# Altium project Power_Clock_proto.PrjPcb
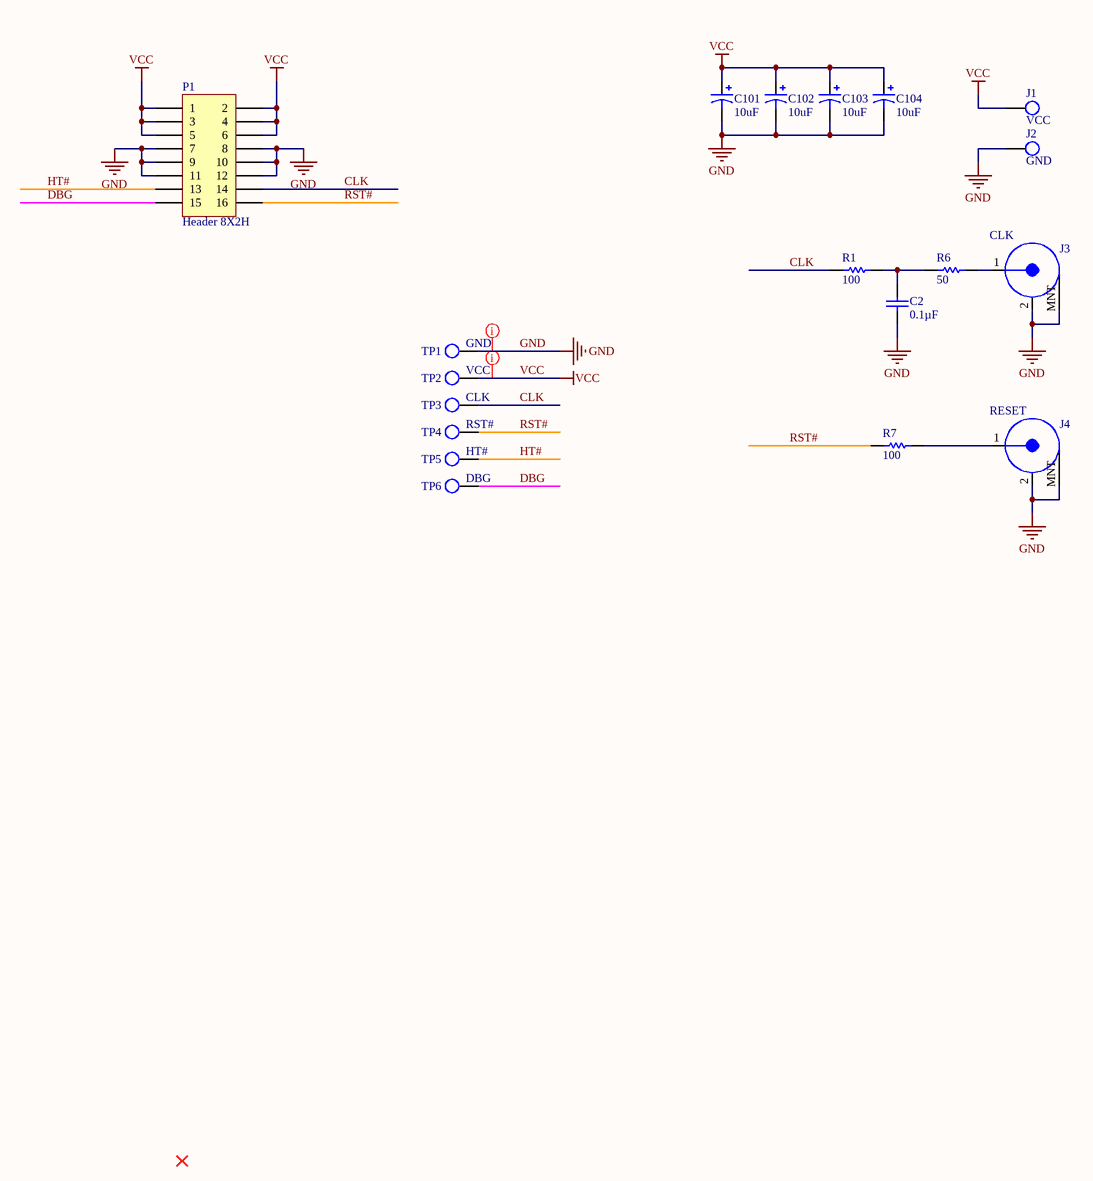
[diagram p0: Sheet1.SchDoc]
2 sheets, 19 parts. Net scope: strictly hierarchical (ports join the sheet entries above them; power ports are local).
Board file: Power_Clock_proto.PcbDoc
Sheets:
  Sheet1.SchDoc
  Sheet2.SchDoc

## Sheet Sheet1.SchDoc
size B; Author: E. Sims; Organization: Let's Build Rockets Inc.; SheetNumber: 1; SheetTotal: 3

### Parts
C2  Capacitance: 0.1µF  [VISH-K104K15X7RF5TL2]  (hidden comment: K104K15X7RF5TL2)
C101  value 10uF  [C5x7]  (hidden comment: Cap Pol5)
C102  value 10uF  [C5x7]  (hidden comment: Cap Pol5)
C103  value 10uF  [C5x7]  (hidden comment: Cap Pol5)
C104  value 10uF  [C5x7]  (hidden comment: Cap Pol5)
J1  VCC  [CT3151SP-2]
J2  GND  [CT3151SP-0]
J3  CLK  [BNC R/A]
J4  RESET  [BNC R/A]
P1  Header 8X2H  [HDR2X8H]
R1  value 100  [AXIAL-0.3]  (hidden comment: Res1)
R6  value 50  [AXIAL-0.3]  (hidden comment: Res1)
R7  value 100  [AXIAL-0.3]  (hidden comment: Res1)
TP1  GND  [KSTN-5011_V]  (no BOM)
TP2  VCC  [KSTN-5011_V]  (no BOM)
TP3  CLK  [KSTN-5011_V]  (no BOM)
TP4  RST#  [KSTN-5011_V]  (no BOM)
TP5  HT#  [KSTN-5011_V]  (no BOM)
TP6  DBG  [KSTN-5011_V]  (no BOM)

### Nets
GND: C2.2 C101.2 C102.2 C103.2 C104.2 J2.1 J3.2 J3.MNT J4.2 J4.MNT P1.7 P1.8 P1.9 P1.10 P1.11 P1.12 TP1.1
VCC: C101.1 C102.1 C103.1 C104.1 J1.1 P1.1 P1.2 P1.3 P1.4 P1.5 P1.6 TP2.1
CLK: P1.14 R1.2 TP3.1
DBG: P1.15 TP6.1
HT#: P1.13 TP5.1
RST#: P1.16 R7.2 TP4.1
NetC2_1: C2.1 R1.1 R6.2
NetJ3_1: J3.1 R6.1
NetJ4_1: J4.1 R7.1

### Layout directives
rule Width Constraint [Pref Width = 20mil    Min Width = 20mil    Max Width = 50mil]; rule Routing Via Style [Pref Size = 35mil    Pref Hole Size = 20mil]; net class PWR: GND, VCC

### Notes on the sheet
- Let's Build Rocket's Inc. Modular Paylaod System Based on TMP-010 Rev
  For more information visit https://github.com/LetsBuildRockets/Modular-Payload-System
  This work is licensed under CC BY-NC 4.0. To view a copy of this license, visit https://creativecommons.org/licenses/by-nc/4.0
- Title
- Size:
- Date:
- Assembly Variant:
- B
- Number:
- Time:
- Revision:
- Sheet
- of
- Author:
- File:

### Library data of the parts
C2 = CMP-2000-06508-1: Ceramic Capacitor, 100 nF, +/- 10%, 50 V, -55 to 125 degC, 2-Pin THD, RoHS, Tape and Reel; Manufacturer: Vishay; Other Names: BC1084CT; Catalog Drawings: Mono-KapSide2-15_5.58Mono-KapSide1_15; Temperature Coefficient: X7R; Voltage - Rated: 50V; Online Catalog: Mono-Kap™Series; Size / Dimension: 0.157"Lx0.098"W(4.00mmx2.50mm); Operating Temperature: -55°C~125°C; Family: CeramicCapacitors; Manufacturer URL: http://www.vishay.com/; Standard Package: 1; Thickness (Max): -; Ratings: -; Datasheet Version: 08/2013; Package Description: 2-Pin Through Hole Device, Body 4 x 2.6 mm; Mounting Type: ThroughHole; Features: -; Lead Spacing: 0.098"(2.50mm); Tolerance: ±10%; Category: Capacitors; Mounting Technology: ThroughHole; Lead Style: Straight; Datasheet URL: http://www.vishay.com/docs/45171/kseries.pdf; Applications: GeneralPurpose; Package / Case: Radial; Height - Seated (Max): 0.220"(5.58mm); Package Reference: K104K15X7RF5TL2; Series: Mono-Kap™K; Packaging: CutTape(CT)
C101-C104 = Cap Pol5: Polarized Capacitor; Published: 8-Jun-2000; LatestRevisionDate: 17-Jul-2002; LatestRevisionNote: Re-released for DXP Platform.; PackageReference: POLAR0.8; Publisher: Altium Limited; PackageDescription: Polarized Capacitor; 2 Leads
J1 = CT3151SP-2: CONN BANANA JACK SOLDER RED; Unit Price (USD): 2.05
J2 = CT3151SP-0: CONN BANANA JACK SOLDER BLACK; Unit Price (USD): 2.05
J3 J4 = RF
P1 = Header 8X2H: Header, 8-Pin, Dual row, Right Angle; System: Connector; LatestRevisionDate: 17-Jul-2002; LatestRevisionNote: Re-released for DXP Platform.; Publisher: Altium Limited
R1 R6 R7 = Res1: Resistor; Published: 8-Jun-2000; LatestRevisionDate: 17-Jul-2002; LatestRevisionNote: Re-released for DXP Platform.; PackageReference: AXIAL-0.3; Publisher: Altium Limited; PackageDescription: Axial Device, Thru-Hole; 2 Leads; 0.3 in Pin Spacing
TP1-TP6 = TP

## Sheet Sheet2.SchDoc
size B; Author: E. Sims; Organization: Let's Build Rockets Inc.; SheetNumber: 2; SheetTotal: 3

### Notes on the sheet
- Let's Build Rocket's Inc. Modular Paylaod System Based on TMP-010 Rev
  For more information visit https://github.com/LetsBuildRockets/Modular-Payload-System
  This work is licensed under CC BY-NC 4.0. To view a copy of this license, visit https://creativecommons.org/licenses/by-nc/4.0
- Title
- Size:
- Date:
- Assembly Variant:
- B
- Number:
- Time:
- Revision:
- Sheet
- of
- Author:
- File: